# Altium schematic sheet Sheet_4.SchDoc
size A3
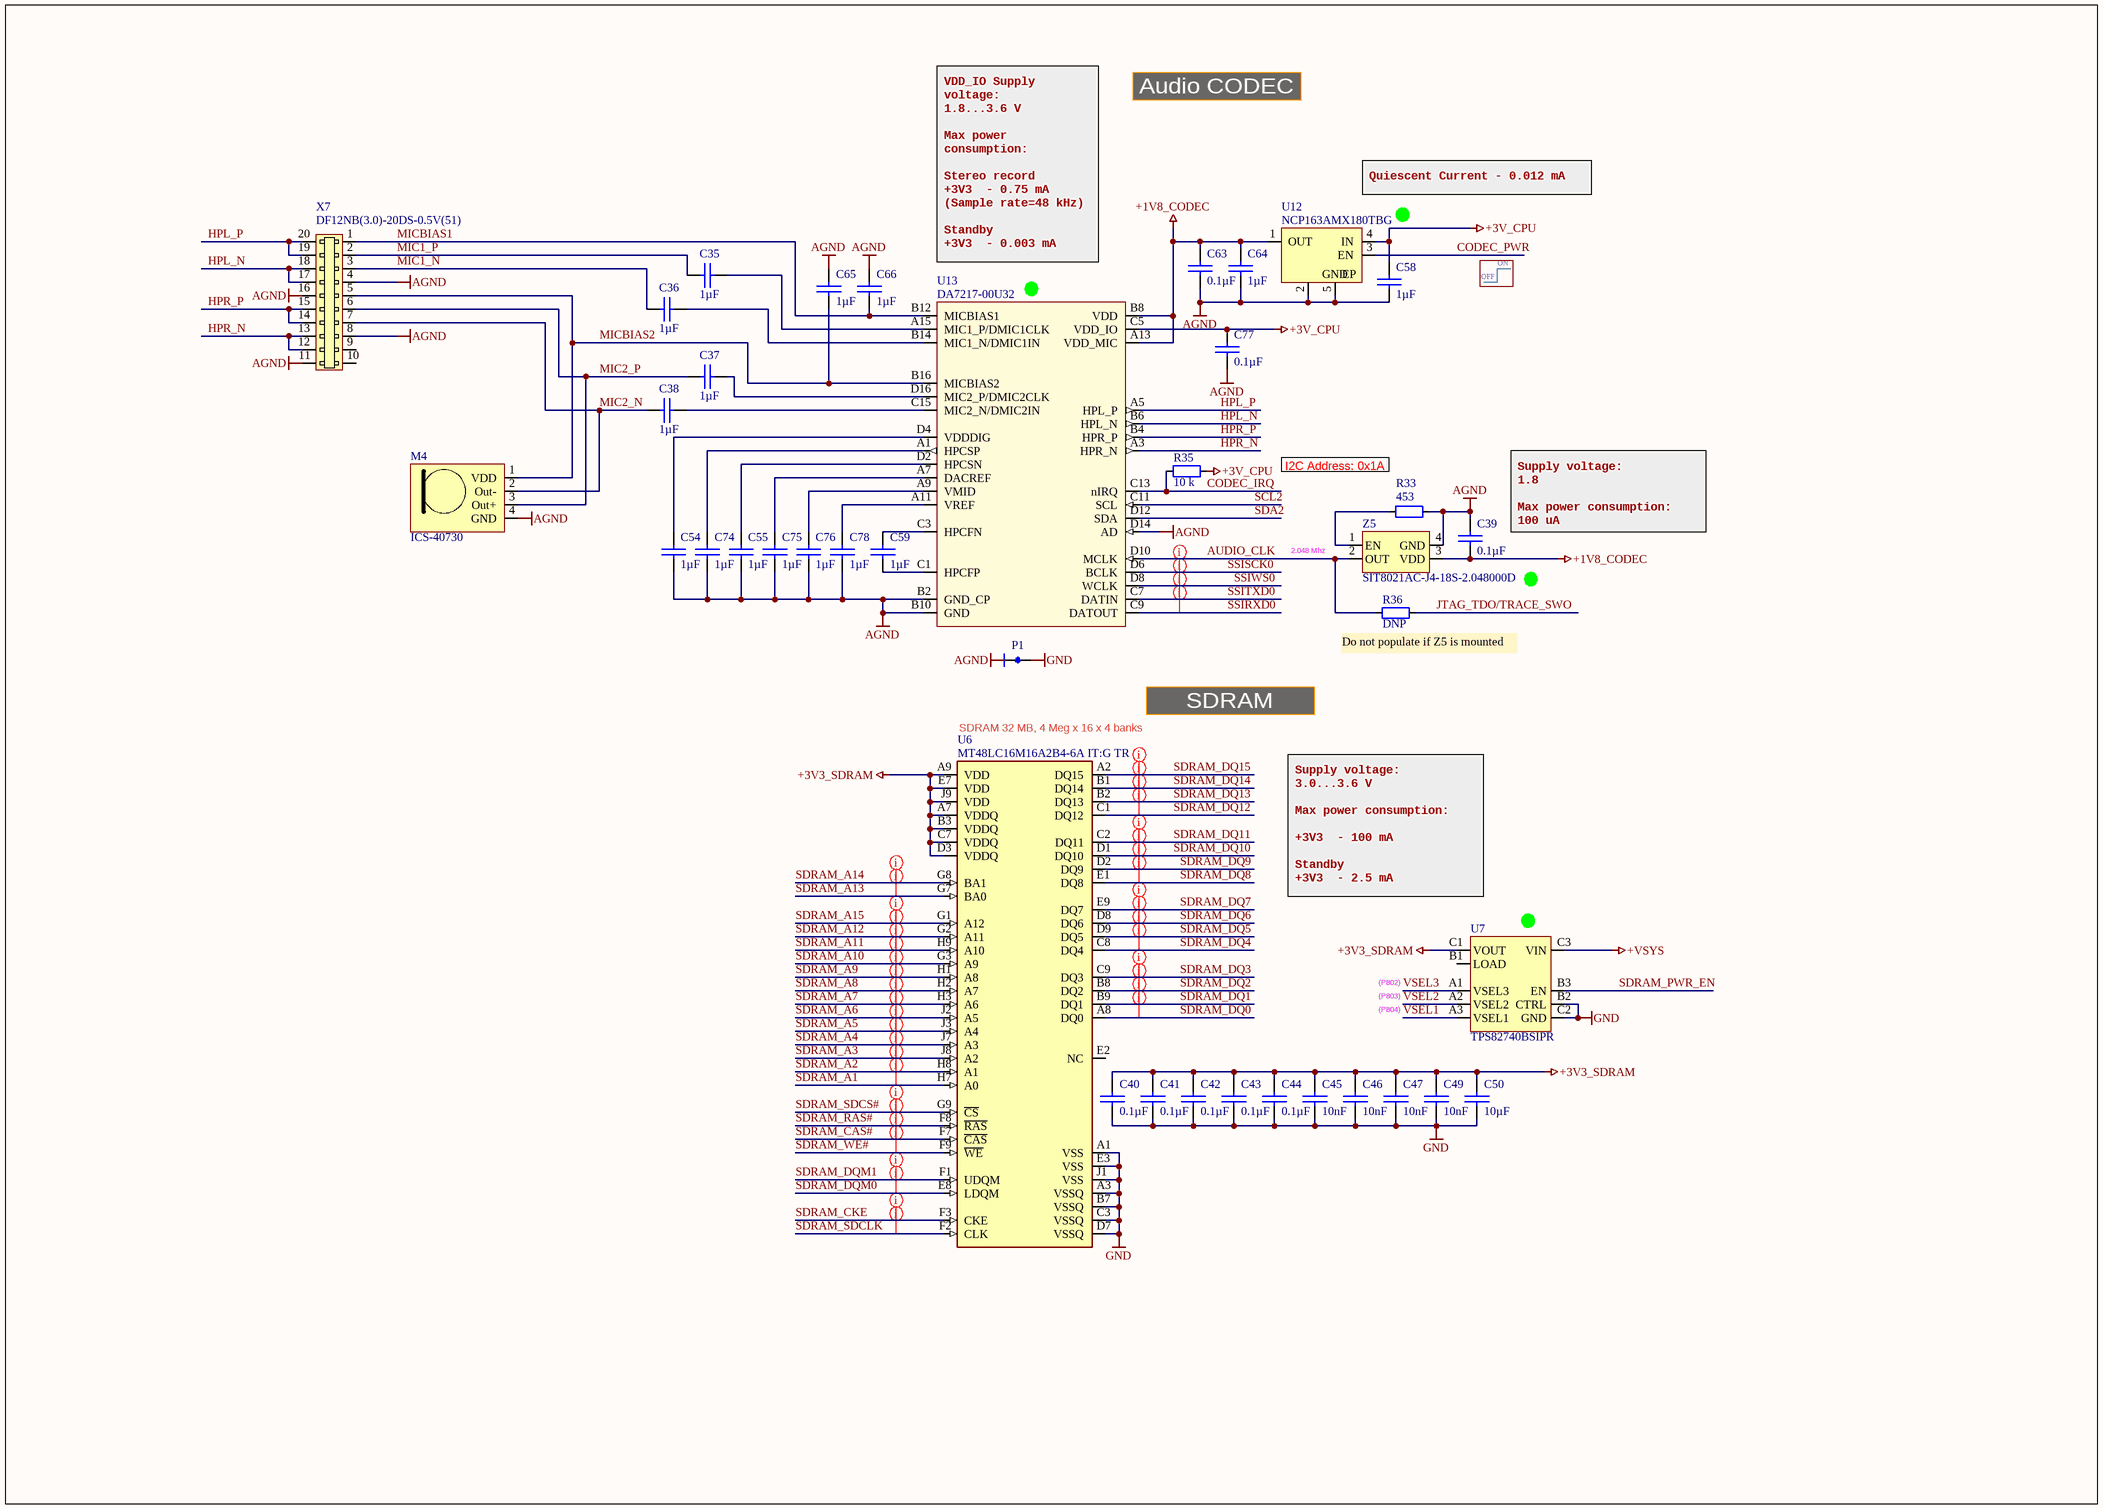
[diagram p0: Sheet_4.SchDoc]

## Parts
C35  value 1µF  [0402 CAP]  (hidden comment: TMK105BJ105MV-F)
C36  value 1µF  [0402 CAP]  (hidden comment: TMK105BJ105MV-F)
C37  value 1µF  [0402 CAP]  (hidden comment: TMK105BJ105MV-F)
C38  value 1µF  [0402 CAP]  (hidden comment: TMK105BJ105MV-F)
C39  value 0.1µF  [0402 CAP]  (hidden comment: 0402B104K500CT)
C40  value 0.1µF  [0402 CAP]  (hidden comment: 0402B104K500CT)
C41  value 0.1µF  [0402 CAP]  (hidden comment: 0402B104K500CT)
C42  value 0.1µF  [0402 CAP]  (hidden comment: 0402B104K500CT)
C43  value 0.1µF  [0402 CAP]  (hidden comment: 0402B104K500CT)
C44  value 0.1µF  [0402 CAP]  (hidden comment: 0402B104K500CT)
C45  value 10nF  [0402 CAP]  (hidden comment: CL05B103KB5NNNC)
C46  value 10nF  [0402 CAP]  (hidden comment: CL05B103KB5NNNC)
C47  value 10nF  [0402 CAP]  (hidden comment: CL05B103KB5NNNC)
C49  value 10nF  [0402 CAP]  (hidden comment: CL05B103KB5NNNC)
C50  value 10µF  [0603 CAP]  (hidden comment: GRT188R61C106KE13D)
C54  value 1µF  [0402 CAP]  (hidden comment: TMK105BJ105MV-F)
C55  value 1µF  [0402 CAP]  (hidden comment: TMK105BJ105MV-F)
C58  value 1µF  [0402 CAP]  (hidden comment: TMK105BJ105MV-F)
C59  value 1µF  [0402 CAP]  (hidden comment: TMK105BJ105MV-F)
C63  value 0.1µF  [0402 CAP]  (hidden comment: 0402B104K500CT)
C64  value 1µF  [0402 CAP]  (hidden comment: TMK105BJ105MV-F)
C65  value 1µF  [0402 CAP]  (hidden comment: TMK105BJ105MV-F)
C66  value 1µF  [0402 CAP]  (hidden comment: TMK105BJ105MV-F)
C74  value 1µF  [0402 CAP]  (hidden comment: TMK105BJ105MV-F)
C75  value 1µF  [0402 CAP]  (hidden comment: TMK105BJ105MV-F)
C76  value 1µF  [0402 CAP]  (hidden comment: TMK105BJ105MV-F)
C77  value 0.1µF  [0402 CAP]  (hidden comment: 0402B104K500CT)
C78  value 1µF  [0402 CAP]  (hidden comment: TMK105BJ105MV-F)
M4  ICS-40730  [ICS-40730]
P1  Net tie 0.1mm  [Net tee 0.1 mm]  (value not drawn)  (net tie, no BOM)
R33  value 453  [0402]  (hidden comment: RMCF0402FT453R)
R35  value 10 k  [0402]  (hidden comment: RMCF0402FT10K0)
R36  value DNP  [0402]  (hidden comment: Resistor)  (no BOM)
U6  MT48LC16M16A2B4-6A IT:G TR  [MICRON_VFBGA54]
U7  TPS82740BSIPR  [MicroSiP]
U12  NCP163AMX180TBG  [4-XDFN]
U13  DA7217-00U32  [Dilaog 34-WLCSP (4.57x1.98)]
X7  DF12NB(3.0)-20DS-0.5V(51)  [DF12NB(3.0)-20DS-0.5V(51)]
Z5  SIT8021AC-J4-18S-2.048000D  [SiT8021]

## Nets
+1V8_CODEC: C39.2 C63.1 C64.1 U12.1(OUT) U13.A13(VDD_MIC) U13.B8(VDD) Z5.3(VDD)
+3V3_SDRAM: C40.1 C41.1 C42.1 C43.1 C44.1 C45.1 C46.1 C47.1 C49.1 C50.1 U6.A7(VDDQ) U6.A9(VDD) U6.B3(VDDQ) U6.C7(VDDQ) U6.D3(VDDQ) U6.E7(VDD) U6.J9(VDD) U7.C1(VOUT)
+3V_CPU: C58.1 C77.1 R35.2 U12.4(IN) U13.C5(VDD_IO)
+VSYS: U7.C3(VIN)
AGND: C39.1 C54.2 C55.2 C58.2 C63.2 C64.2 C65.1 C66.1 C74.2 C75.2 C76.2 C77.2 C78.2 M4.4(GND) P1.1 R33.1 U12.2(GND) U12.5(EP) U13.B2(GND_CP) U13.B10(GND) U13.D14(AD) X7.4 X7.8 X7.11 X7.16 Z5.4(GND)
GND: C40.2 C41.2 C42.2 C43.2 C44.2 C45.2 C46.2 C47.2 C49.2 C50.2 P1.2 U6.A1(VSS) U6.A3(VSSQ) U6.B7(VSSQ) U6.C3(VSSQ) U6.D7(VSSQ) U6.E3(VSS) U6.J1(VSS) U7.B2(CTRL) U7.C2(GND)
AUDIO_CLK: R36.2 U13.D10(MCLK) Z5.2(OUT)
CODEC_IRQ: R35.1 U13.C13(nIRQ)
CODEC_PWR: U12.3(EN)
HPL_N: U13.B6(HPL_N) X7.17 X7.18
HPL_P: U13.A5(HPL_P) X7.19 X7.20
HPR_N: U13.A3(HPR_N) X7.12 X7.13
HPR_P: U13.B4(HPR_P) X7.14 X7.15
JTAG_TDO/TRACE_SWO: R36.1
MIC1_N: C36.1 X7.3
MIC1_P: C35.1 X7.2
MIC2_N: C38.1 M4.2(Out-) X7.7
MIC2_P: C37.1 M4.3(Out+) X7.6
MICBIAS1: C66.2 U13.B12(MICBIAS1) X7.1
MICBIAS2: C65.2 M4.1(VDD) U13.B16(MICBIAS2) X7.5
SCL2: U13.C11(SCL)
SDA2: U13.D12(SDA)
SDRAM_A1: U6.H7(A0)
SDRAM_A2: U6.H8(A1)
SDRAM_A3: U6.J8(A2)
SDRAM_A4: U6.J7(A3)
SDRAM_A5: U6.J3(A4)
SDRAM_A6: U6.J2(A5)
SDRAM_A7: U6.H3(A6)
SDRAM_A8: U6.H2(A7)
SDRAM_A9: U6.H1(A8)
SDRAM_A10: U6.G3(A9)
SDRAM_A11: U6.H9(A10)
SDRAM_A12: U6.G2(A11)
SDRAM_A13: U6.G7(BA0)
SDRAM_A14: U6.G8(BA1)
SDRAM_A15: U6.G1(A12)
SDRAM_CAS#: U6.F7(~{CAS})
SDRAM_CKE: U6.F3(CKE)
SDRAM_DQ0: U6.A8(DQ0)
SDRAM_DQ1: U6.B9(DQ1)
SDRAM_DQ2: U6.B8(DQ2)
SDRAM_DQ3: U6.C9(DQ3)
SDRAM_DQ4: U6.C8(DQ4)
SDRAM_DQ5: U6.D9(DQ5)
SDRAM_DQ6: U6.D8(DQ6)
SDRAM_DQ7: U6.E9(DQ7)
SDRAM_DQ8: U6.E1(DQ8)
SDRAM_DQ9: U6.D2(DQ9)
SDRAM_DQ10: U6.D1(DQ10)
SDRAM_DQ11: U6.C2(DQ11)
SDRAM_DQ12: U6.C1(DQ12)
SDRAM_DQ13: U6.B2(DQ13)
SDRAM_DQ14: U6.B1(DQ14)
SDRAM_DQ15: U6.A2(DQ15)
SDRAM_DQM0: U6.E8(LDQM)
SDRAM_DQM1: U6.F1(UDQM)
SDRAM_PWR_EN: U7.B3(EN)
SDRAM_RAS#: U6.F8(~{RAS})
SDRAM_SDCLK: U6.F2(CLK)
SDRAM_SDCS#: U6.G9(~{CS})
SDRAM_WE#: U6.F9(~{WE})
SSIRXD0: U13.C9(DATOUT)
SSISCK0: U13.D6(BCLK)
SSITXD0: U13.C7(DATIN)
SSIWS0: U13.D8(WCLK)
VSEL1: U7.A3(VSEL1)
VSEL2: U7.A2(VSEL2)
VSEL3: U7.A1(VSEL3)
NetC35_2: C35.2 U13.A15(MIC1_P/DMIC1CLK)
NetC36_2: C36.2 U13.B14(MIC1_N/DMIC1IN)
NetC37_2: C37.2 U13.D16(MIC2_P/DMIC2CLK)
NetC38_2: C38.2 U13.C15(MIC2_N/DMIC2IN)
NetC54_1: C54.1 U13.D4(VDDDIG)
NetC55_1: C55.1 U13.D2(HPCSN)
NetC59_1: C59.1 U13.C3(HPCFN)
NetC59_2: C59.2 U13.C1(HPCFP)
NetC74_1: C74.1 U13.A1(HPCSP)
NetC75_1: C75.1 U13.A7(DACREF)
NetC76_1: C76.1 U13.A9(VMID)
NetC78_1: C78.1 U13.A11(VREF)
NetR33_2: R33.2 Z5.1(EN)

Not connected (* = marked no-connect by the designer): U6 E2(NC); U7 B1(LOAD); X7 9(5) 10(6)

## Layout directives
net class SSI: SSIRXD0, SSISCK0, SSITXD0, SSIWS0
net class SDRAM_D: SDRAM_DQ0, SDRAM_DQ1, SDRAM_DQ2, SDRAM_DQ3, SDRAM_DQ4, SDRAM_DQ5, SDRAM_DQ6, SDRAM_DQ7, SDRAM_DQ8, SDRAM_DQ9, SDRAM_DQ10, SDRAM_DQ11, SDRAM_DQ12, SDRAM_DQ13, SDRAM_DQ14, SDRAM_DQ15
net class SDRAM_A: SDRAM_A1, SDRAM_A2, SDRAM_A3, SDRAM_A4, SDRAM_A5, SDRAM_A6, SDRAM_A7, SDRAM_A8, SDRAM_A9, SDRAM_A10, SDRAM_A11, SDRAM_A12, SDRAM_A13, SDRAM_A14, SDRAM_A15
net class SDRAM_C: SDRAM_CAS#, SDRAM_CKE, SDRAM_DQM0, SDRAM_DQM1, SDRAM_RAS#, SDRAM_SDCLK, SDRAM_SDCS#, SDRAM_WE#

## Notes on the sheet
- Audio CODEC
- (near U12) Quiescent Current - 0.012 mA
- VDD_IO Supply voltage:
  1.8...3.6 V
  Max power consumption:
  Stereo record
  +3V3  - 0.75 mA (Sample rate=48 kHz)
  Standby
  +3V3  - 0.003 mA
- OFF
- ON
- (near R33) I2C Address: 0x1A
- (near Z5) 2.048 Mhz
- (near C39) Supply voltage:
  1.8
  Max power consumption:
  100 uA
- (near R36) Do not populate if Z5 is mounted
- SDRAM
- SDRAM 32 MB, 4 Meg x 16 x 4 banks
- Supply voltage:
  3.0...3.6 V
  Max power consumption:
  +3V3  - 100 mA
  Standby
  +3V3  - 2.5 mA
- (P802)
- (P804)
- (P803)

## Library data of the parts
C35-C38 C54 C55 C58 C59 C64-C66 C74-C76 C78 = TMK105BJ105MV-F: 1µF, ±20%, 25V, X5R, 0402 (1005 Metric), -55°C ~ 85°C, -, General Purpose; Manufacturer: Taiyo Yuden; PartNum: 587-3245-1-ND; Voltage - Rated: 25V; Part Number: TMK105BJ105MV-F; Distributor: Digi-Key; PartName: TMK105BJ105MV-F; Price: 0.22000; Tolerance: ±20%; Temperature Coefficient: X5R; Operating Temperature: -55°C ~ 85°C; Features: -; Package / Case: 0402 (1005 Metric)
C39-C44 C63 C77 = 0402B104K500CT: 0.1µF, ±10%, 50V, X7R, 0402 (1005 Metric), -55°C ~ 125°C, -, General Purpose; Manufacturer: Walsin Technology Corporation; PartNum: 1292-1176-1-ND; Voltage - Rated: 50V; Part Number: 0402B104K500CT; Distributor: Digi-Key; PartName: 0402B104K500CT; Price: 0.19000; Tolerance: ±10%; Temperature Coefficient: X7R; Operating Temperature: -55°C ~ 125°C; Features: -; Package / Case: 0402 (1005 Metric)
C45-C47 C49 = CL05B103KB5NNNC: 10000pF, ±10%, 50V, X7R, 0402 (1005 Metric), -55°C ~ 125°C, -, General Purpose; Manufacturer: Samsung Electro-Mechanics; PartNum: 1276-1028-1-ND; Voltage - Rated: 50V; Part Number: CL05B103KB5NNNC; Distributor: Digi-Key; PartName: CL05B103KB5NNNC; Price: 0.10000; Tolerance: ±10%; Temperature Coefficient: X7R; Operating Temperature: -55°C ~ 125°C; Features: -; Package / Case: 0402 (1005 Metric)
C50 = GRT188R61C106KE13D: 10µF, ±10%, 16V, X5R, 0603 (1608 Metric), -55°C ~ 85°C, -, Automotive; Manufacturer: Murata Electronics North America; PartNum: 490-12317-1-ND; Voltage - Rated: 16V; Part Number: GRT188R61C106KE13D; Distributor: Digi-Key; PartName: GRT188R61C106KE13D; Price: 0.22770; Tolerance: ±10%; Temperature Coefficient: X5R; Operating Temperature: -55°C ~ 85°C; Features: -; Package / Case: 0603 (1608 Metric)
M4 = ICS-40730: 25Hz ~ 20kHz Analog Microphone MEMS (Silicon) 1.5V ~ 3.63V Noise Cancelling (-32dB ±2dB @ 124dB SPL) Solder Pads; Manufacturer: TDK InvenSense; PartNum: 1428-1141-1-ND; Distributor: Digi-Key; PartName: ICS-40730
R33 = RMCF0402FT453R: 453 Ohms, ±1%, 0.063W, 1/16W, Thick Film, ±100ppm/°C, 0402 (1005 Metric), -55°C ~ 155°C, Automotive AEC-Q200; Manufacturer: Stackpole Electronics Inc; PartNum: RMCF0402FT453RCT-ND; Voltage: 75V; Distributor: Digi-Key; Price: 0.10000; Tolerance: ±1%; PartName: RMCF0402FT453R; Part Number: RMCF0402FT453R; Temperature Coefficient: ±100ppm/°C; Operating Temperature: -55°C ~ 155°C; Power (Watts): 0.063W, 1/16W; Features: Automotive AEC-Q200; Package / Case: 0402 (1005 Metric)
R35 = RMCF0402FT10K0: 10 kOhms, ±1%, 0.063W, 1/16W, Thick Film, ±100ppm/°C, 0402 (1005 Metric), -55°C ~ 155°C, Automotive AEC-Q200; Manufacturer: Stackpole Electronics Inc; PartNum: RMCF0402FT10K0CT-ND; Voltage: 75V; Distributor: Digi-Key; Price: 0.10000; Tolerance: ±1%; PartName: RMCF0402FT10K0; Part Number: RMCF0402FT10K0; Temperature Coefficient: ±100ppm/°C; Operating Temperature: -55°C ~ 155°C; Power (Watts): 0.063W, 1/16W; Features: Automotive AEC-Q200; Package / Case: 0402 (1005 Metric)
R36 = RMCF0402FT10K0: Power (Watts): 0.063W, 1/16W; Distributor: Digi-Key; Package / Case: 0402 (1005 Metric)
U6 = MT48LC16M16A2B4-6A IT:G TR: Micron SDRAM 256M-Bit 16Mx16, 3.3V, 167MHz, 6ns, -40°C ~ +85°C, 54-VFBGA (8x8) Pb-free; Manufacturer: Micron Technology Inc.; PartNum: 340-128306-REEL; Distributor: Mouser; PartName: MT48LC16M16A2B4-6A IT:G TR; Price: 8$
U7 = TPS82740BSIPR: Non-Isolated PoL Module DC DC Converter 1 Output 2.6 ~ 3.3V 200mA 2.2V - 5.5V Input, 3.0mm x 2.4mm x 1.0mm, -40...85 C; Manufacturer: Texas Instruments; PartNum: 296-46481-1-ND; Distributor: Digi-Key; price: 2.88$; PartName: TPS82740BSIPR
U12 = NCP163AMX180TBG: LDO 1.8V, 250 mA, Vin < 5.5V, Iq < 20uA, -40..+125 C,  4-XDFN (1x1); Manufacturer: ON Semiconductor; PartNum: NCP163AMX180TBGOSCT-ND; Price: 0.29$; Distributor: Digi-Key; PartName: NCP163AMX180TBG
U13 = DA7217-00U32: Low power CODEC, 24 b, 2/2, I²C, I²S,  1.5V ~ 3.6V,  -25°C ~ 85°C, 34-WLCSP (4.57x1.98); Manufacturer: Dialog Semiconductor GmbH; PartNum: 1564-1043-1-ND; Price: 2.38$; Distributor: Digi-Key; PartName: DA7217-00U32
X7 = DF12NB(3.0)-20DS-0.5V(51): 20 Position Connector Receptacle, Center Strip Contacts Surface Mount Gold, height 2.2 mm, pitch 0.5 mm, Mated Stacking Heights 3mm; Manufacturer: Hirose Electric; PartNum: 26-DF12NB(3.0)-20DS-0.5V(51)CT-ND - Cut Tape (CT); Price: 064$; Distributor: Digi-Key; PartName: DF12NB(3.0)-20DS-0.5V(51); System: Connector
Z5 = SIT8021AC-J4-18S-2.048000D: 2.048MHz XO (Standard) LVCMOS Oscillator 1.8V Standby (Power Down) 4-UFBGA, CSPBGA, -20...+70 C; Manufacturer: SiTIME; Distributor: Rochester Electronics; Price: 0.6$; PartNum: SIT8021AC-J4-18S-2.048000D; Value: 2.048MHz; PartName: SIT8021AC-J4-18S-2.048000D